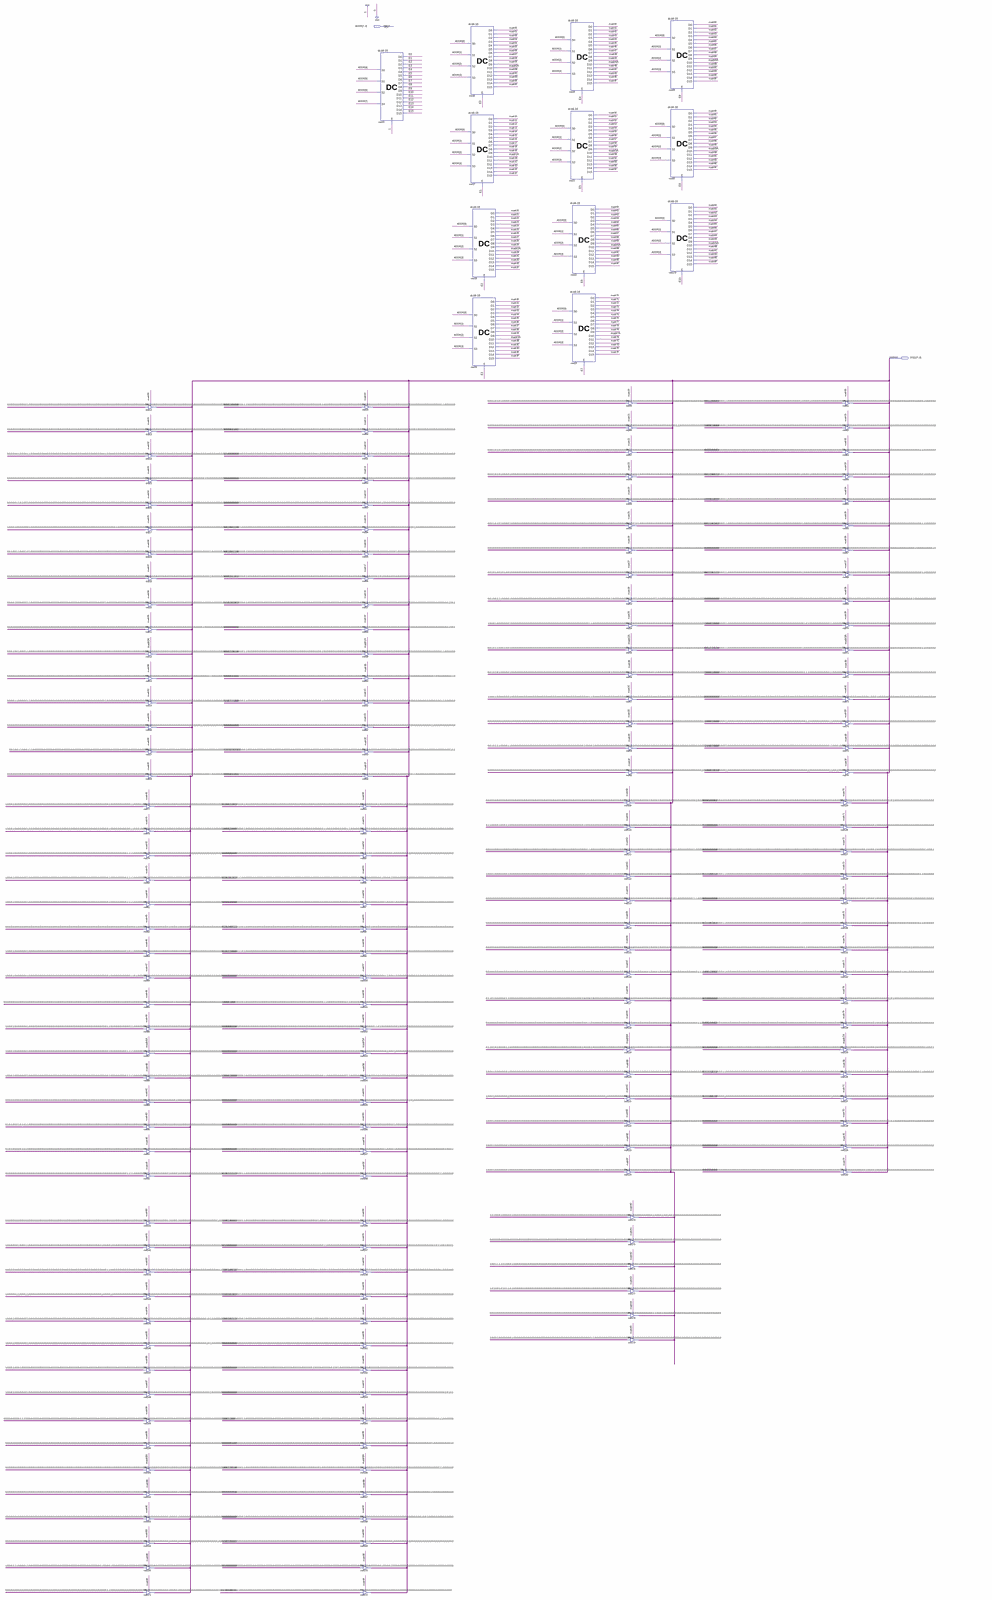
[diagram p0: schematic sheet, whole]
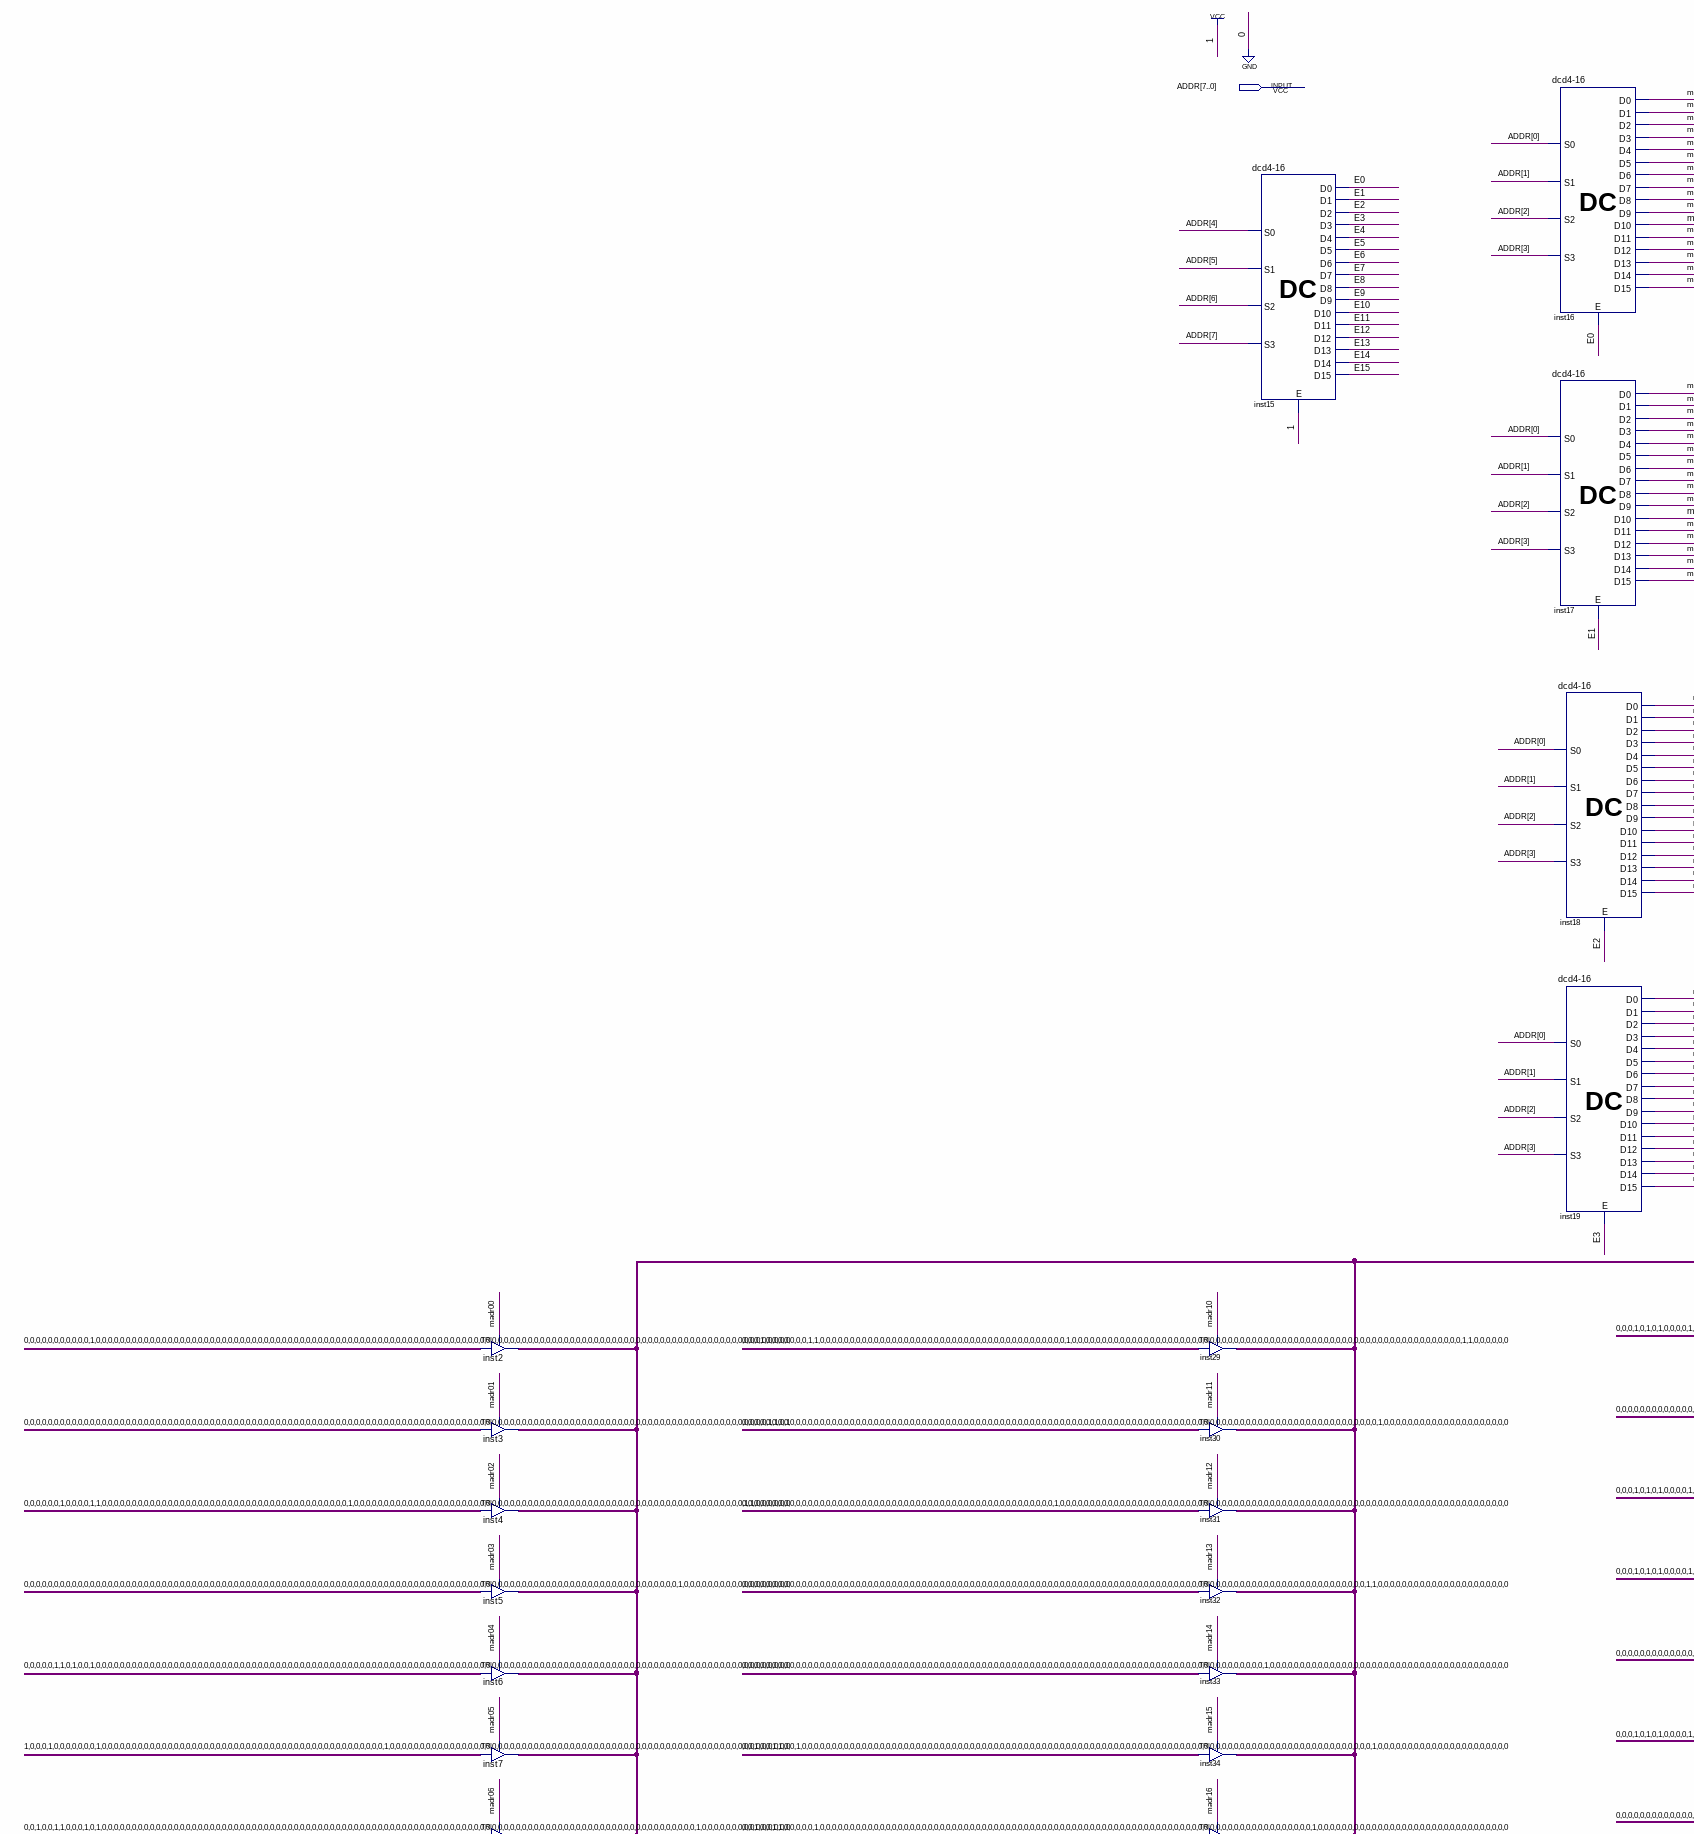
[diagram p1: schematic sheet, upper left part]
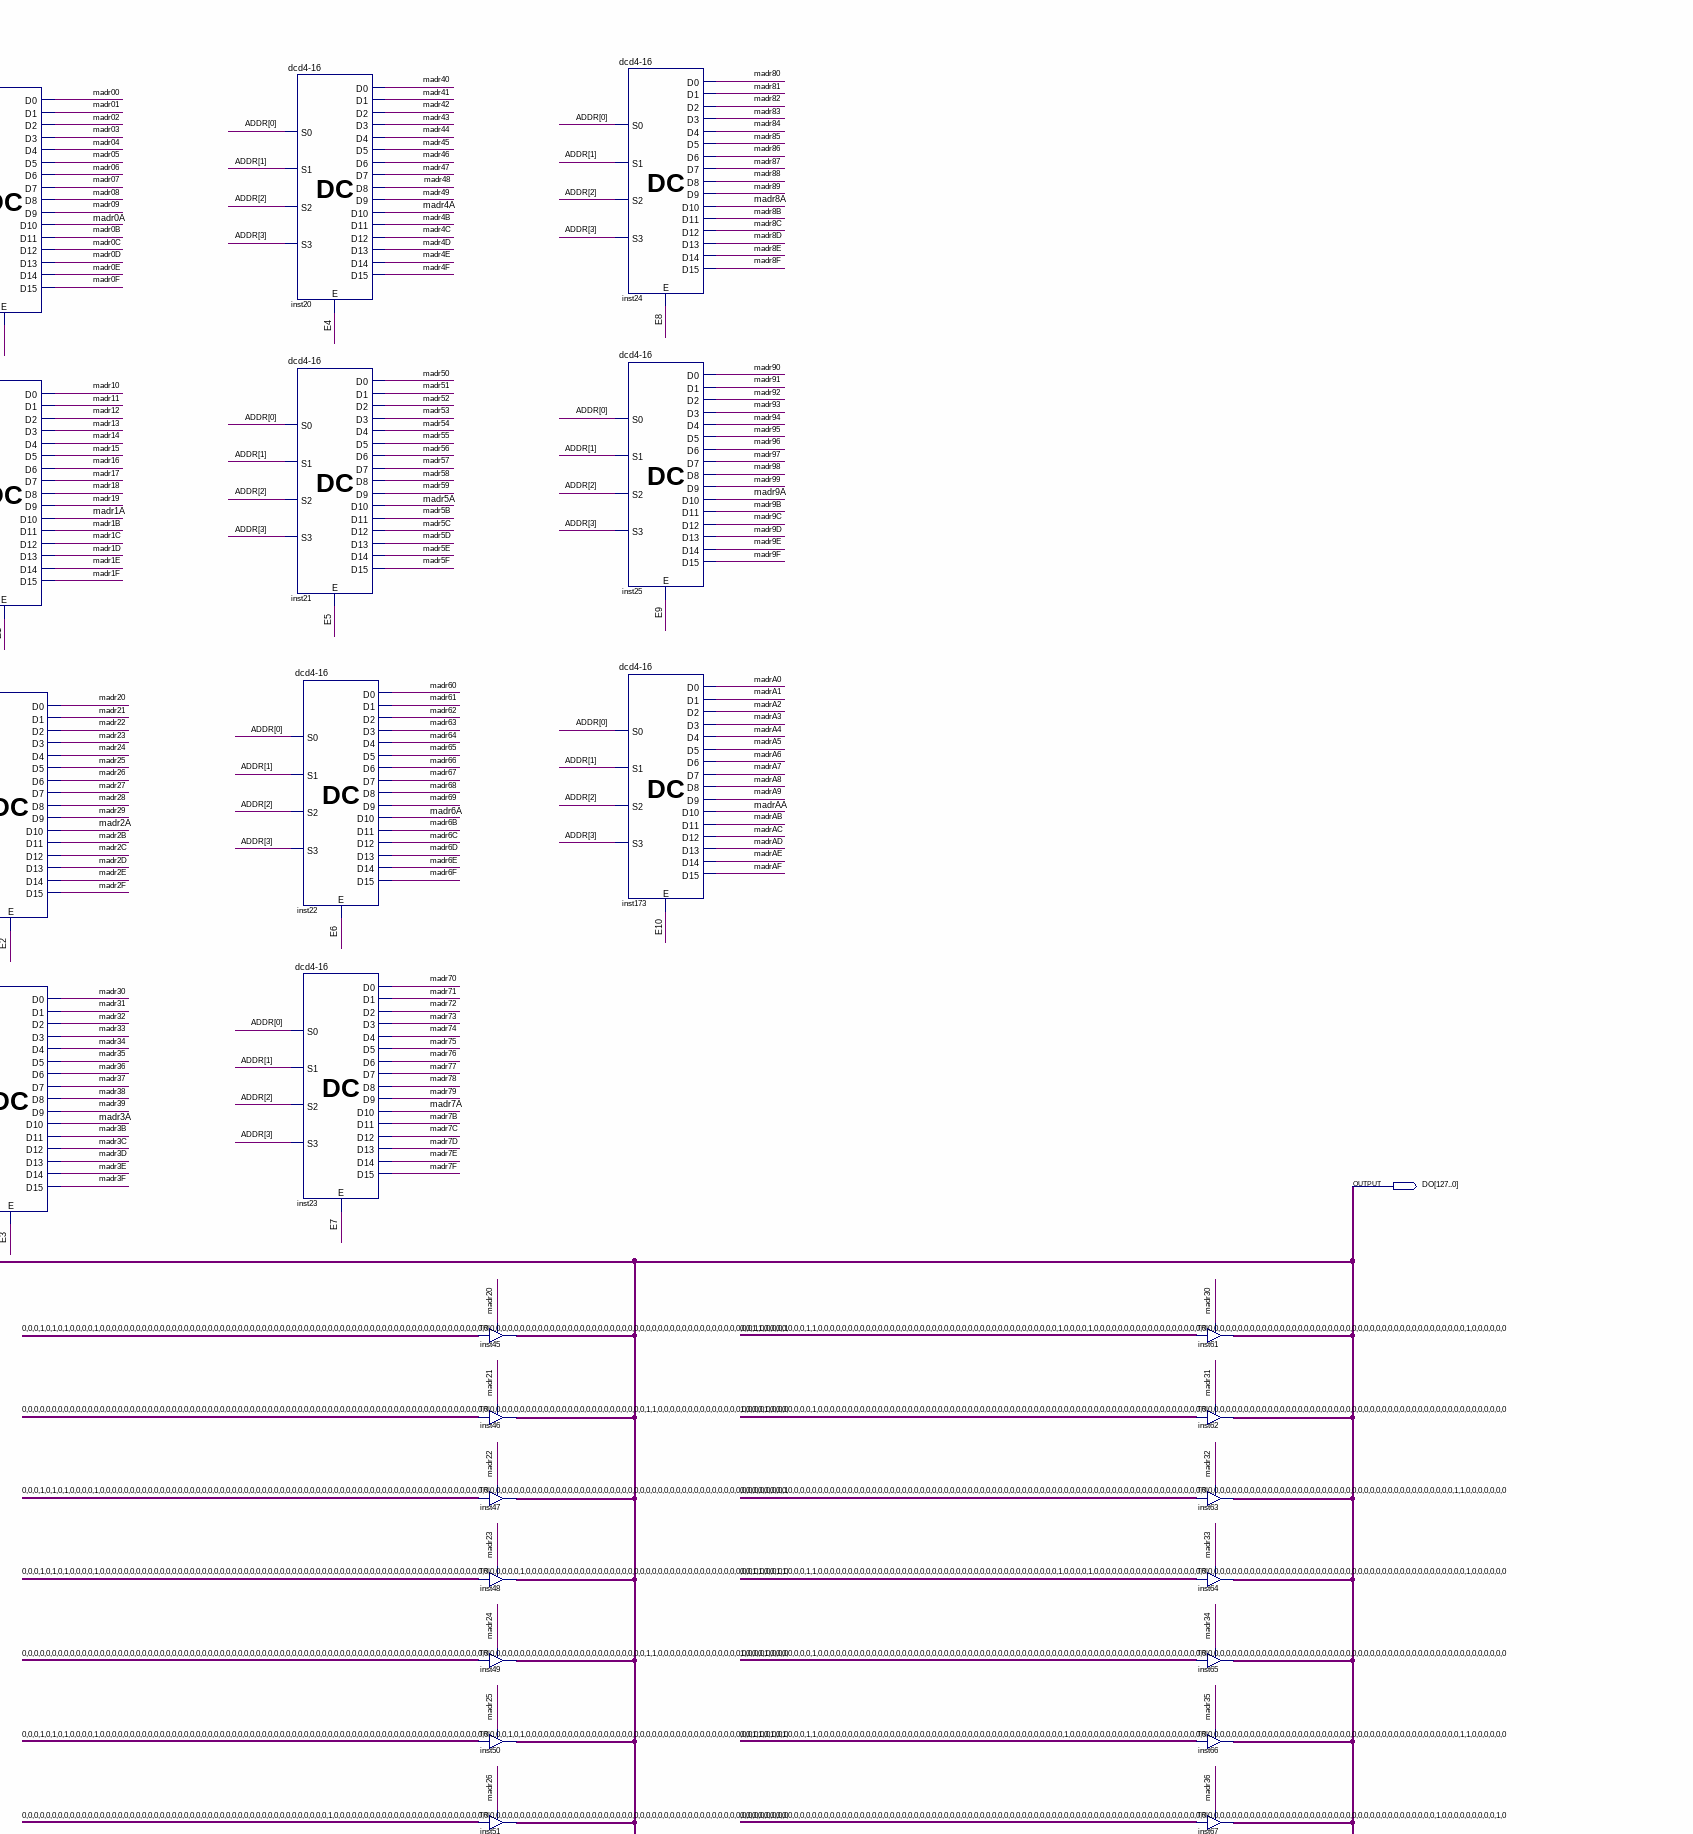
[diagram p2: schematic sheet, upper right part]
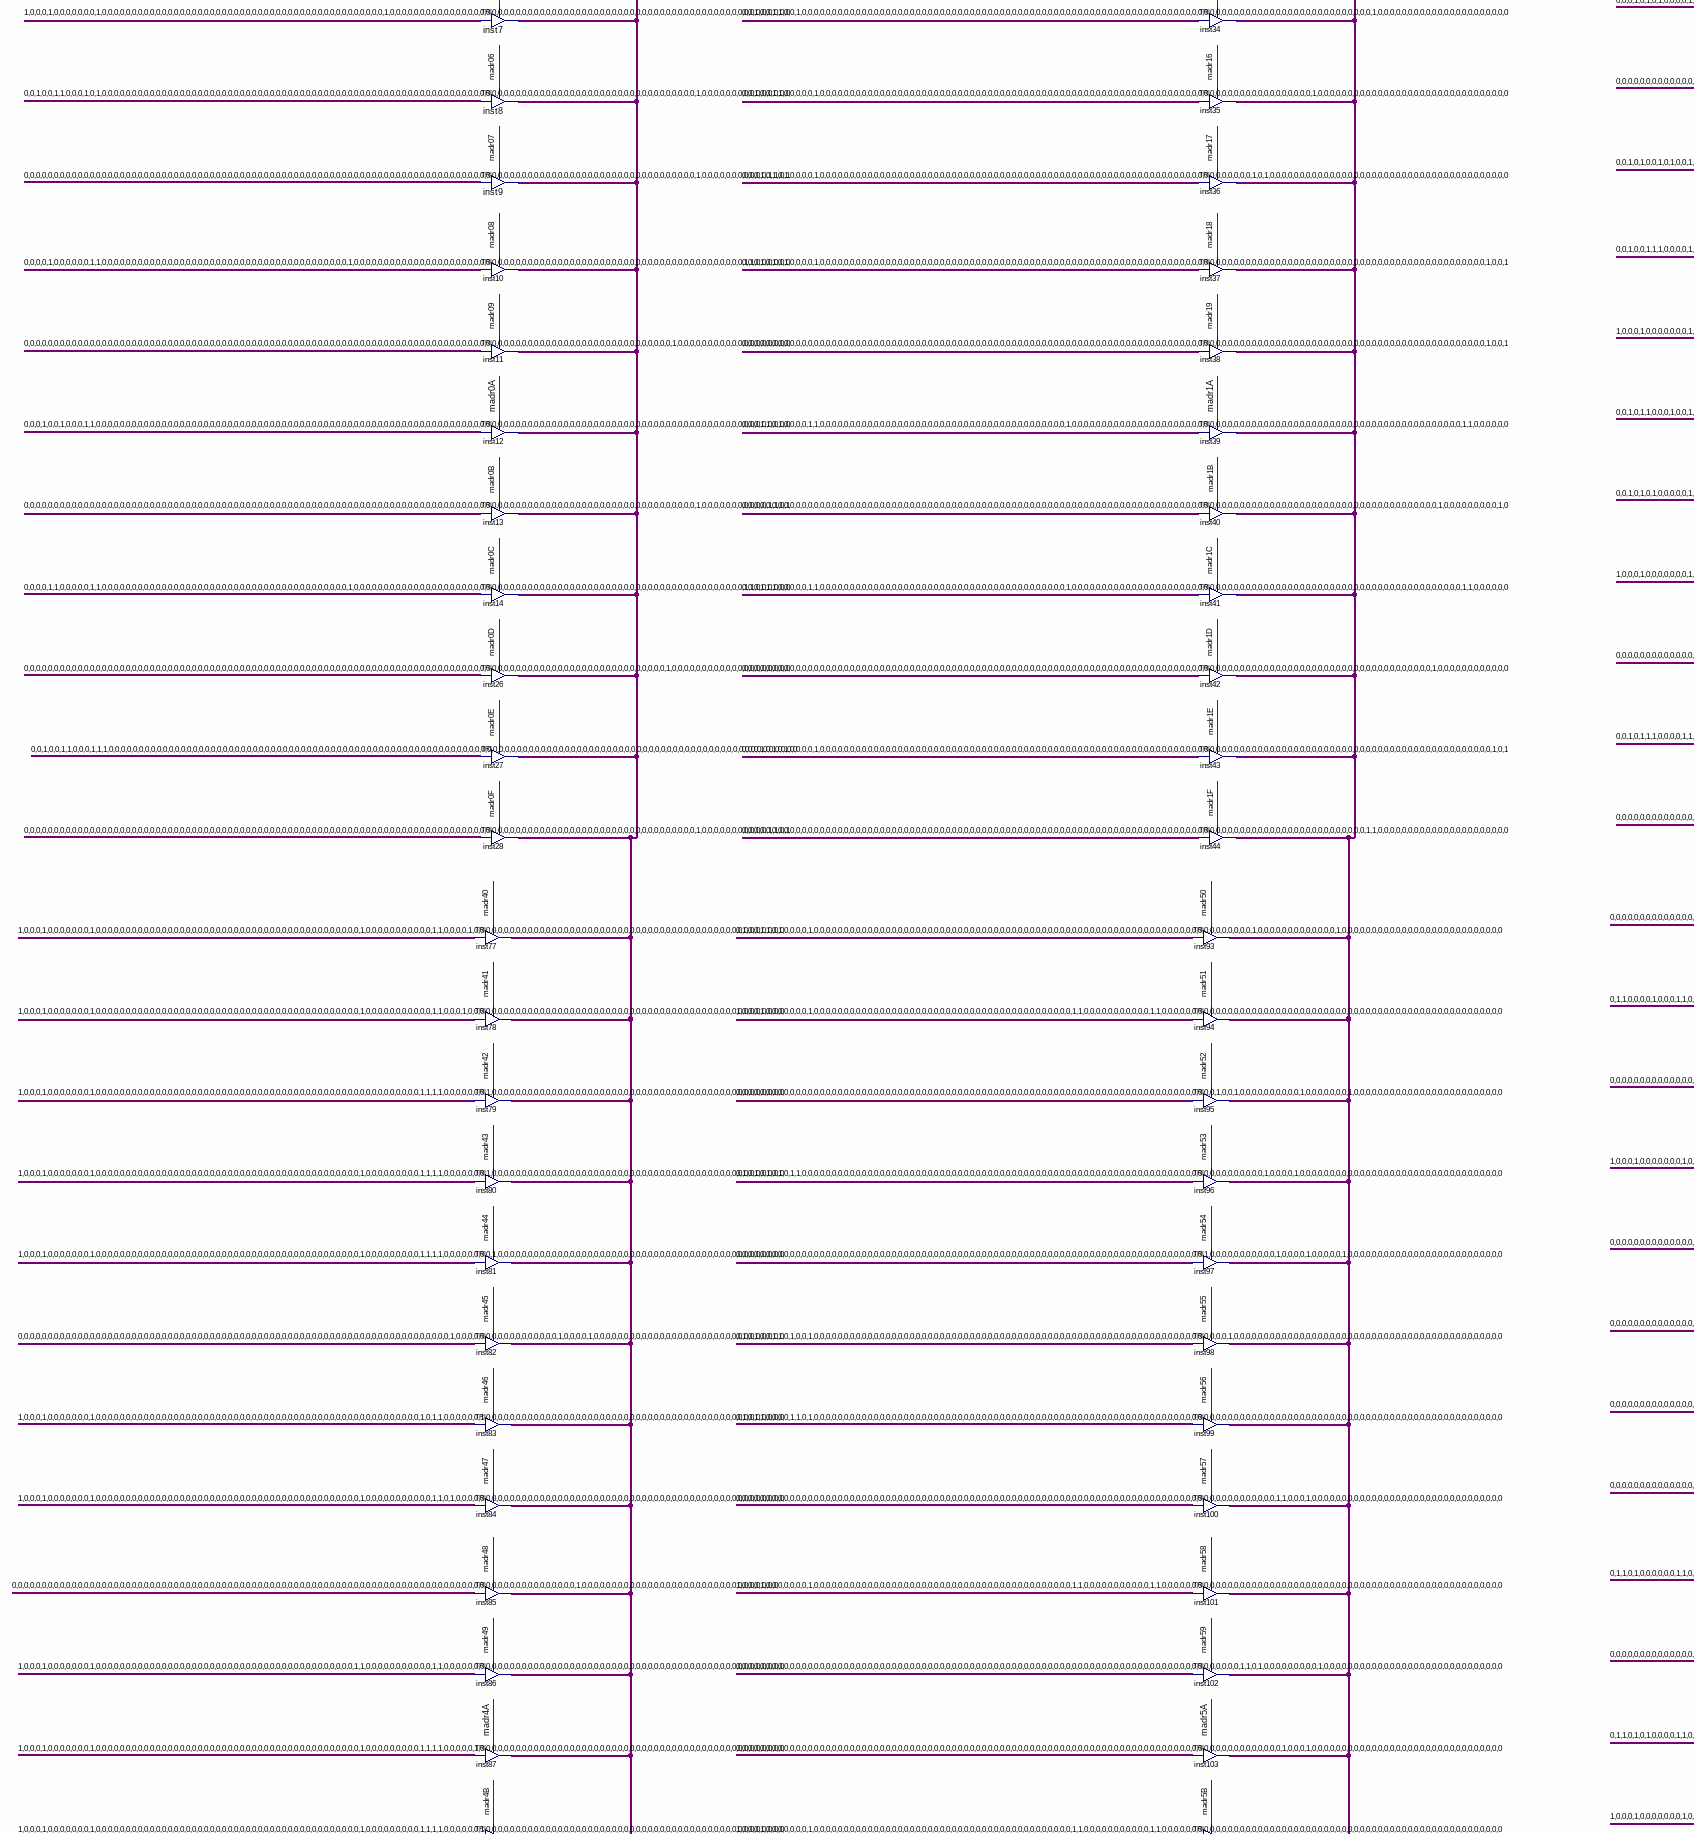
[diagram p3: schematic sheet, middle left part]
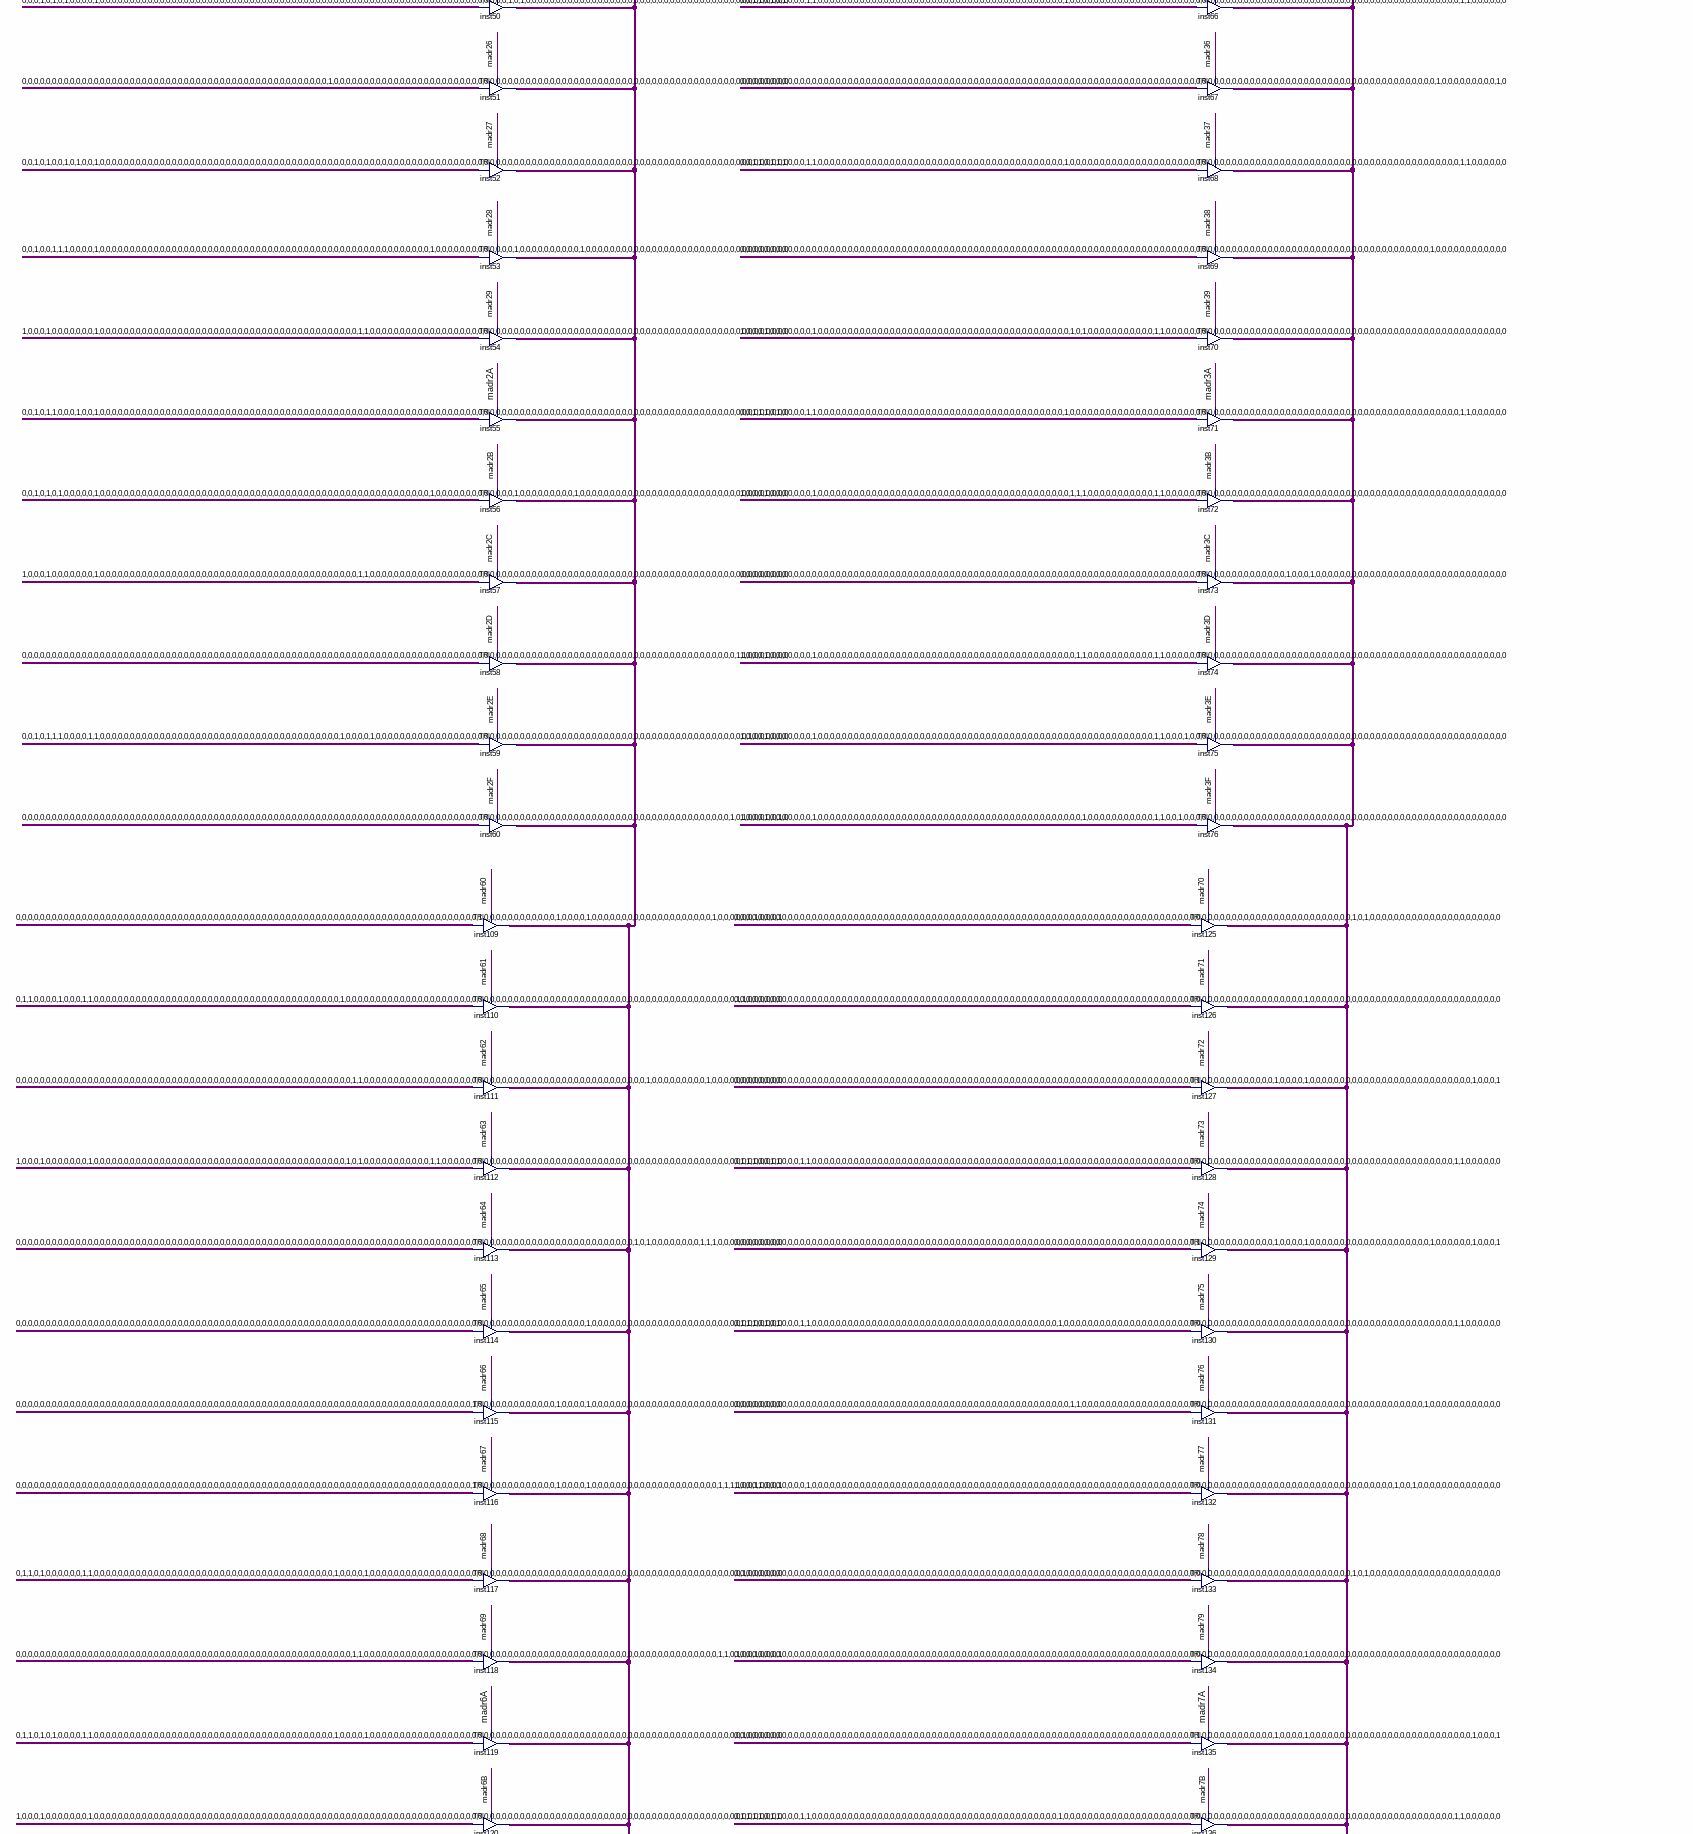
[diagram p4: schematic sheet, middle right part]
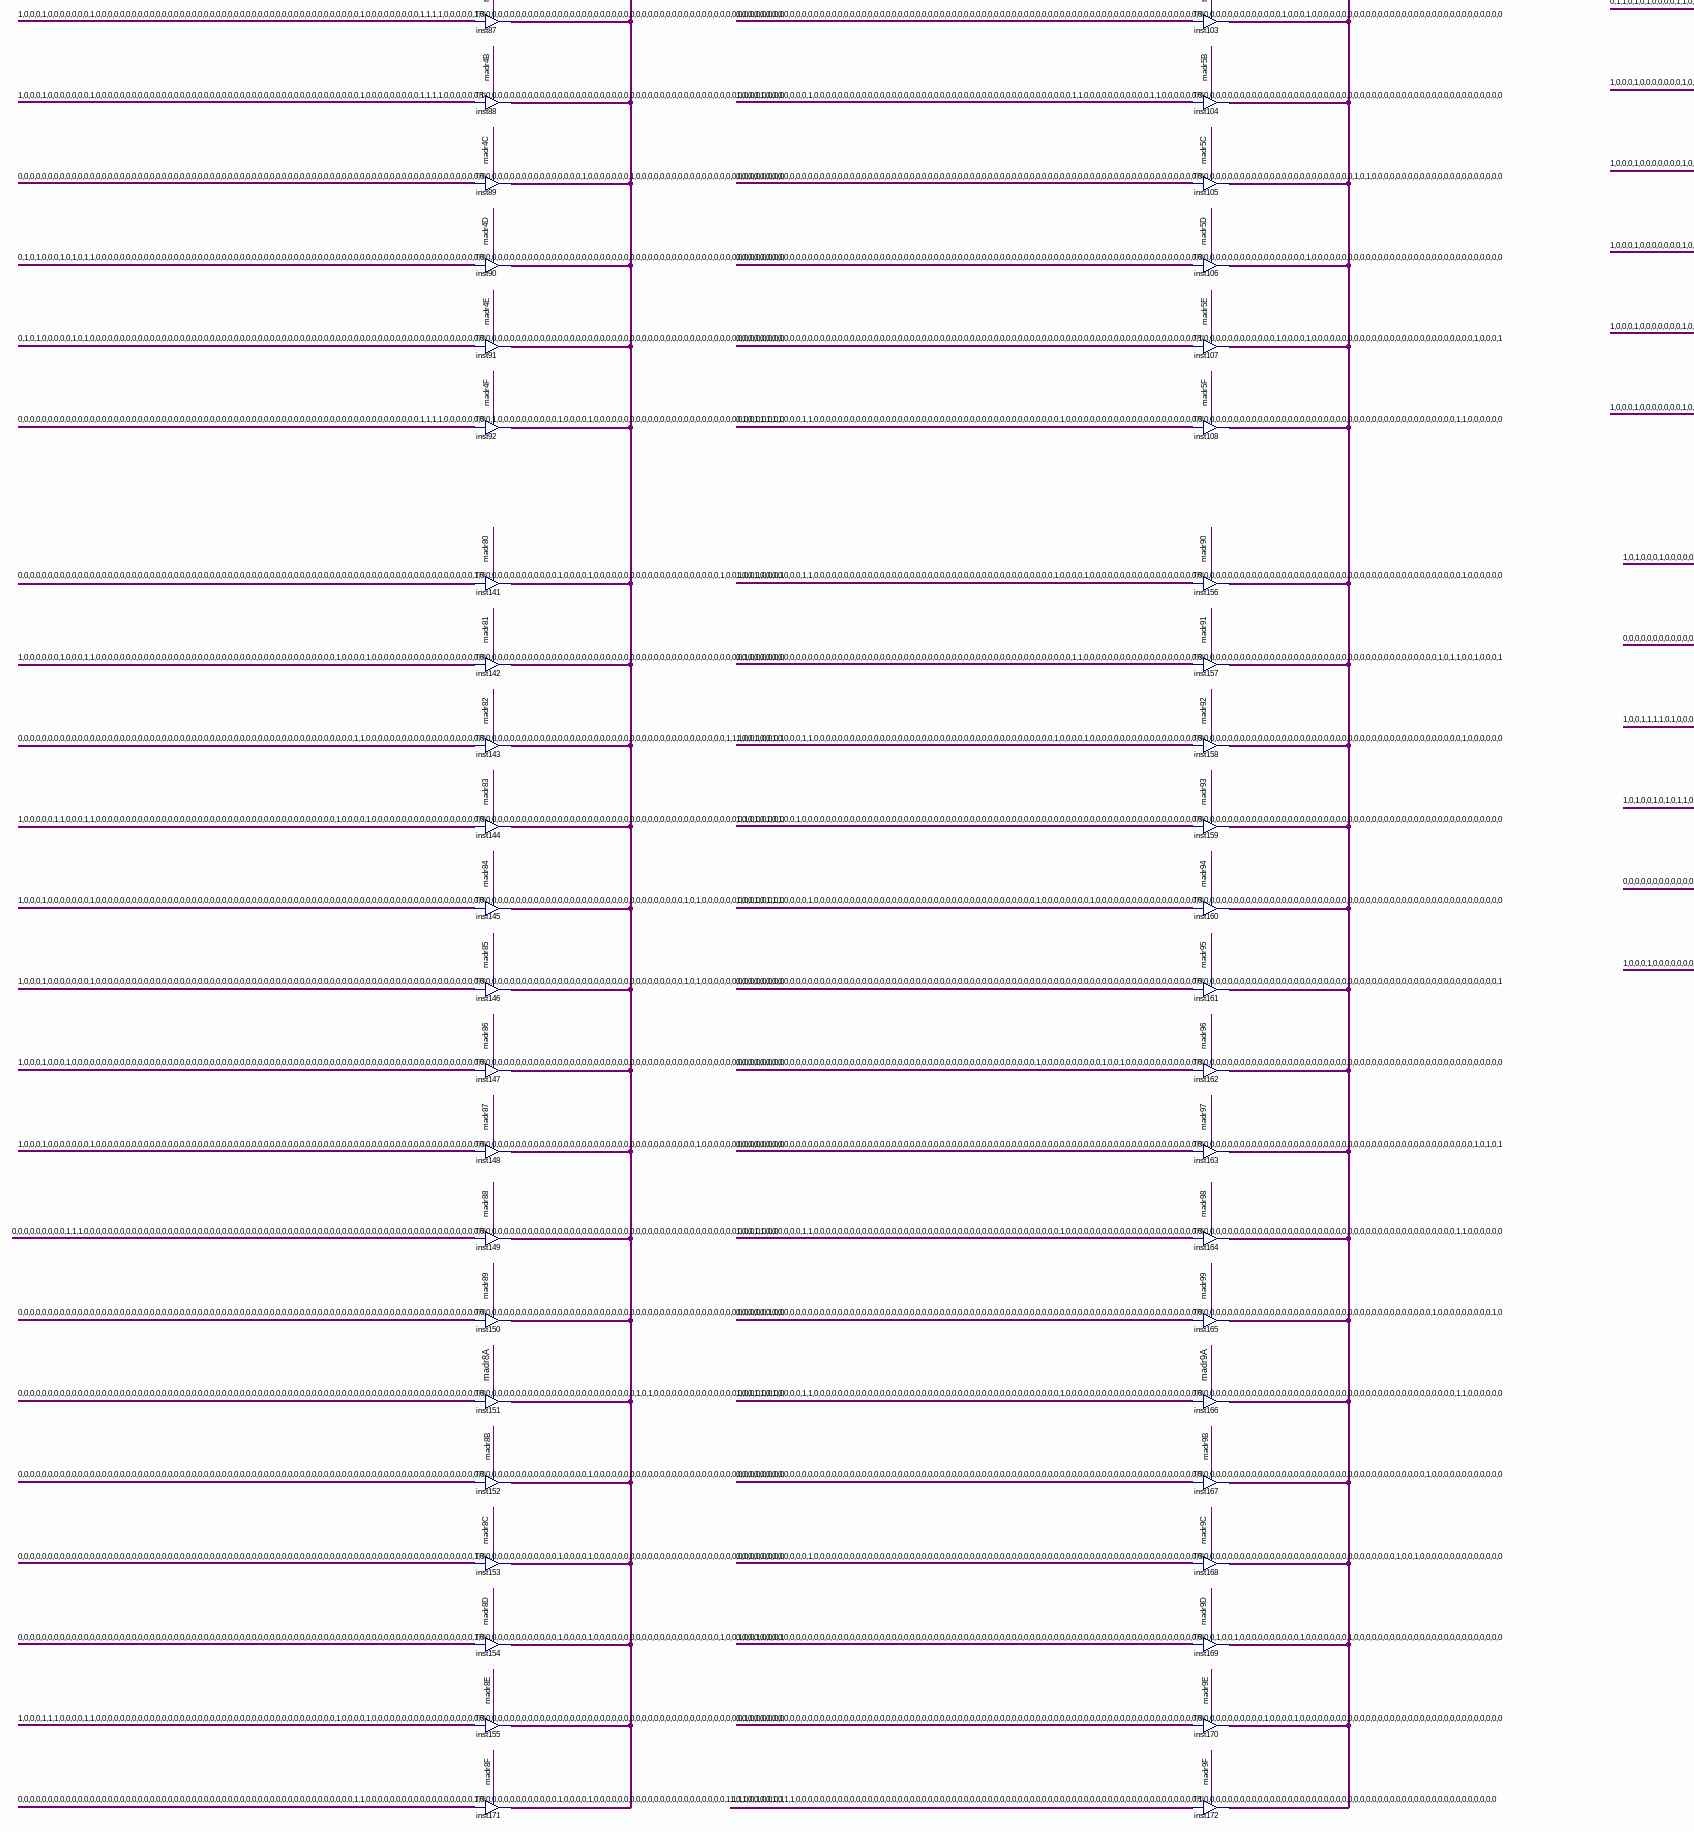
[diagram p5: schematic sheet, lower left part]
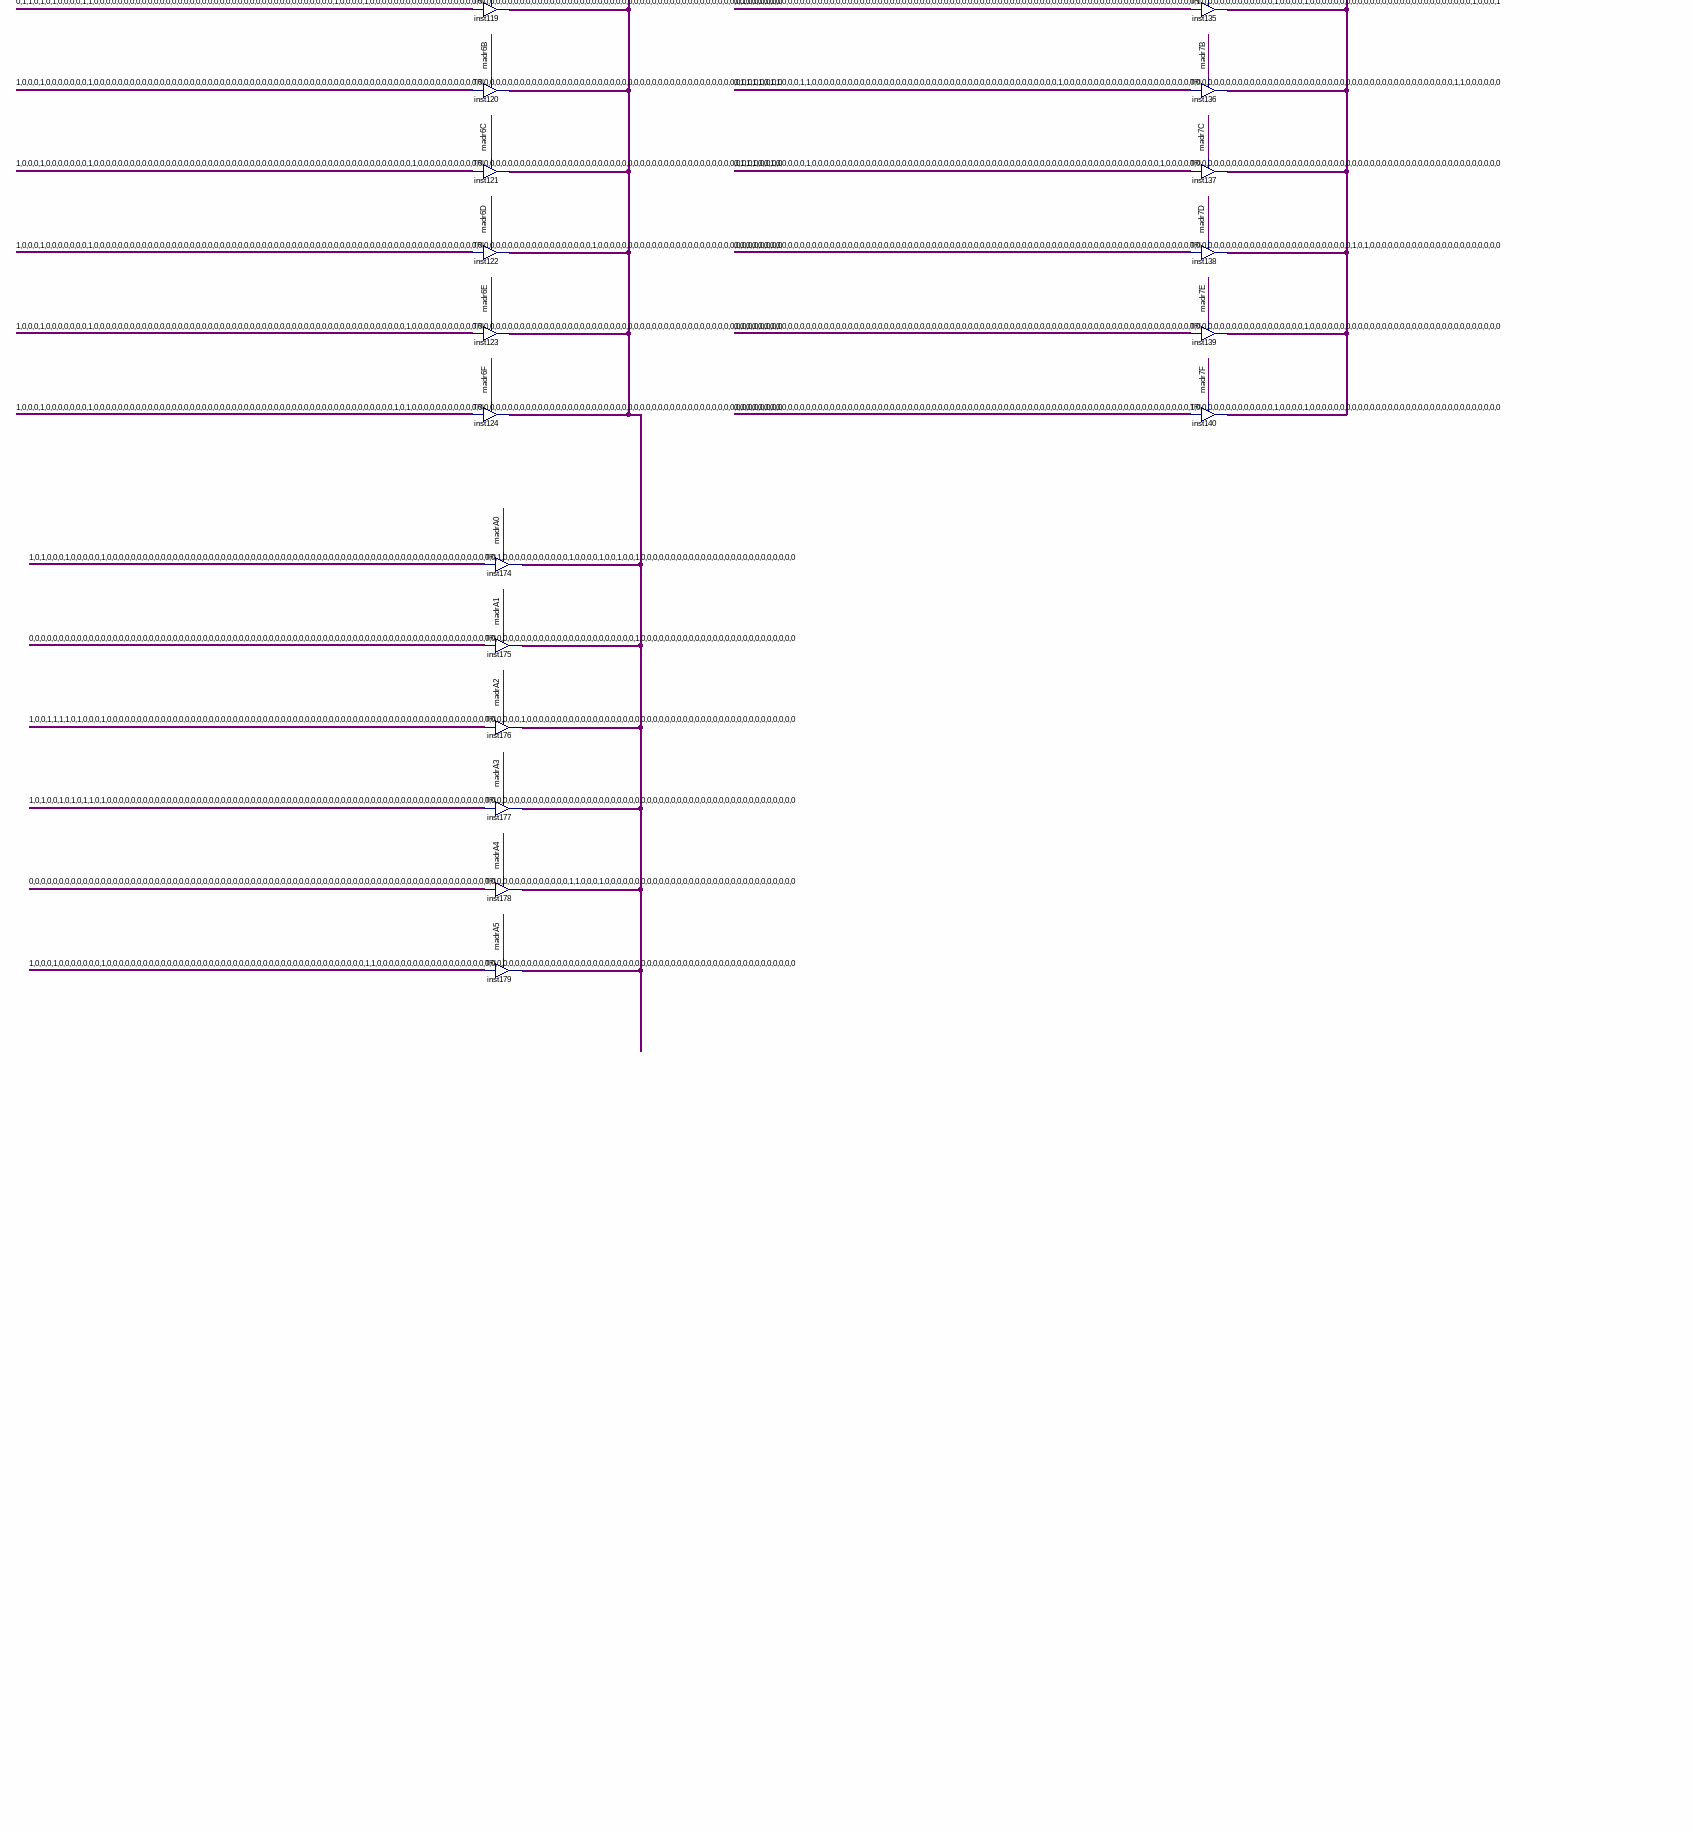
[diagram p6: schematic sheet, lower right part]
// Quartus schematic microProgram.bdf as structural Verilog: 178 symbols, 2 pins
module microProgram (
  input  [7:0] ADDR,
  output [127:0] DO
);

  wire E0, E1, E2, E3, E4, E5, E6, E7, E8, E9, E10, E11, E12, E13, E14, E15, madr00, madr0A, madr0B, madr0C,
       madr0D, madr0E, madr0F, madr01, madr1A, madr1B, madr1C, madr1D, madr1E, madr1F, madr02, madr2A,
       madr2B, madr2C, madr2D, madr2E, madr2F, madr03, madr3A, madr3B, madr3C, madr3D, madr3E, madr3F,
       madr04, madr4A, madr4B, madr4C, madr4D, madr4E, madr4F, madr05, madr5A, madr5B, madr5C, madr5D,
       madr5E, madr5F, madr06, madr6A, madr6B, madr6C, madr6D, madr6E, madr6F, madr07, madr7A, madr7B,
       madr7C, madr7D, madr7E, madr7F, madr08, madr8A, madr8B, madr8C, madr8D, madr8E, madr8F, madr09,
       madr9A, madr9B, madr9C, madr9D, madr9E, madr9F, madr10, madr11, madr12, madr13, madr14, madr15,
       madr16, madr17, madr18, madr19, madr20, madr21, madr22, madr23, madr24, madr25, madr26, madr27,
       madr28, madr29, madr30, madr31, madr32, madr33, madr34, madr35, madr36, madr37, madr38, madr39,
       madr40, madr41, madr42, madr43, madr44, madr45, madr46, madr47, madr48, madr49, madr50, madr51,
       madr52, madr53, madr54, madr55, madr56, madr57, madr58, madr59, madr60, madr61, madr62, madr63,
       madr64, madr65, madr66, madr67, madr68, madr69, madr70, madr71, madr72, madr73, madr74, madr75,
       madr76, madr77, madr78, madr79, madr80, madr81, madr82, madr83, madr84, madr85, madr86, madr87,
       madr88, madr89, madr90, madr91, madr92, madr93, madr94, madr95, madr96, madr97, madr98, madr99,
       madrA0, madrA1, madrA2, madrA3, madrA4, madrA5, madrA6, madrA7, madrA8, madrA9, madrAA, madrAB,
       madrAC, madrAD, madrAE, madrAF;

  TRI inst2[127:0] (
    .IN(128'b00000000000100000000000000000000000000000000000000000000000000000000000000000000000000000000000000000000000000000000000000000000),
    .OE(madr00), .OUT(DO));
  TRI inst3[127:0] (
    .IN(128'b00000000000000000000000000000000000000000000000000000000000000000000000000000000000000000000000000000000000000000000000000001101),
    .OE(madr01), .OUT(DO));
  TRI inst4[127:0] (
    .IN(128'b00000010000110000000000000000000000000000000000000000010000000000000000000000000000000000000000000000000000000000000000011000000),
    .OE(madr02), .OUT(DO));
  TRI inst5[127:0] (
    .IN(128'b00000000000000000000000000000000000000000000000000000000000000000000000000000000000000000000000000000000000001000000000000000000),
    .OE(madr03), .OUT(DO));
  TRI inst6[127:0] (
    .IN(128'b00000110100100000000000000000000000000000000000000000000000000000000000000000000000000000000000000000000000000000000000000000000),
    .OE(madr04), .OUT(DO));
  TRI inst7[127:0] (
    .IN(128'b10001000000010000000000000000000000000000000000000000000000010000000000000000000000000000000000000000000000000000000000000000000),
    .OE(madr05), .OUT(DO));
  TRI inst8[127:0] (
    .IN(128'b00100110001010000000000000000000000000000000000000000000000000000000000000000000000000000000000000000000000000001000000000000000),
    .OE(madr06), .OUT(DO));
  TRI inst9[127:0] (
    .IN(128'b00000000000000000000000000000000000000000000000000000000000000000000000000000000000000000000000000000000000000001000000000001101),
    .OE(madr07), .OUT(DO));
  TRI inst10[127:0] (
    .IN(128'b00001000000110000000000000000000000000000000000000000010000000000000000000000000000000000000000000000000000000000000000011000000),
    .OE(madr08), .OUT(DO));
  TRI inst11[127:0] (
    .IN(128'b00000000000000000000000000000000000000000000000000000000000000000000000000000000000000000000000000000000000010000000000000000000),
    .OE(madr09), .OUT(DO));
  TRI inst12[127:0] (
    .IN(128'b00010010001100000000000000000000000000000000000000000000000000000000000000000000000000000000000000000000000000000000000000000000),
    .OE(madr0A), .OUT(DO));
  TRI inst13[127:0] (
    .IN(128'b00000000000000000000000000000000000000000000000000000000000000000000000000000000000000000000000000000000000000001000000000001101),
    .OE(madr0B), .OUT(DO));
  TRI inst14[127:0] (
    .IN(128'b00001100000110000000000000000000000000000000000000000010000000000000000000000000000000000000000000000000000000000000000011000000),
    .OE(madr0C), .OUT(DO));
  TRI inst26[127:0] (
    .IN(128'b00000000000000000000000000000000000000000000000000000000000000000000000000000000000000000000000000000000000100000000000000000000),
    .OE(madr0D), .OUT(DO));
  TRI inst27[127:0] (
    .IN(128'b00100110001110000000000000000000000000000000000000000000000000000000000000000000000000000000000000000000000000000000000000000000),
    .OE(madr0E), .OUT(DO));
  TRI inst28[127:0] (
    .IN(128'b00000000000000000000000000000000000000000000000000000000000000000000000000000000000000000000000000000000000000001000000000001101),
    .OE(madr0F), .OUT(DO));
  TRI inst77[127:0] (
    .IN(128'b10001000000010000000000000000000000000000000000000000000010000000000011000010000000000000000000000000000000000000000000000000000),
    .OE(madr40), .OUT(DO));
  TRI inst78[127:0] (
    .IN(128'b10001000000010000000000000000000000000000000000000000000010000000000011000100000000000000000000000000000000000000000000000000000),
    .OE(madr41), .OUT(DO));
  TRI inst79[127:0] (
    .IN(128'b10001000000010000000000000000000000000000000000000000000000000000001111000000010000000000000000000000000000000000000000000000000),
    .OE(madr42), .OUT(DO));
  TRI inst80[127:0] (
    .IN(128'b10001000000010000000000000000000000000000000000000000000010000000001111000000010000000000000000000000000000000000000000000000000),
    .OE(madr43), .OUT(DO));
  TRI inst81[127:0] (
    .IN(128'b10001000000010000000000000000000000000000000000000000000010000000001111000000001000000000000000000000000000000000000000000000000),
    .OE(madr44), .OUT(DO));
  TRI inst82[127:0] (
    .IN(128'b00000000000000000000000000000000000000000000000000000000000000000000000010000000000000000010000100000000000000000000000000000000),
    .OE(madr45), .OUT(DO));
  TRI inst83[127:0] (
    .IN(128'b10001000000010000000000000000000000000000000000000000000000000000001011000000100000000000000000000000000000000000000000000000000),
    .OE(madr46), .OUT(DO));
  TRI inst84[127:0] (
    .IN(128'b10001000000010000000000000000000000000000000000000000000010000000000011010000000000000000000000000000000000000000000000000000000),
    .OE(madr47), .OUT(DO));
  TRI inst85[127:0] (
    .IN(128'b00000000000000000000000000000000000000000000000000000000000000000000000000000000000000000000001000000000000000000000000000000000),
    .OE(madr48), .OUT(DO));
  TRI inst86[127:0] (
    .IN(128'b10001000000010000000000000000000000000000000000000000000110000000000011000000000000000000000000000000000000000000000000000000000),
    .OE(madr49), .OUT(DO));
  TRI inst87[127:0] (
    .IN(128'b10001000000010000000000000000000000000000000000000000000010000000001111000001000000000000000000000000000000000000000000000000000),
    .OE(madr4A), .OUT(DO));
  TRI inst88[127:0] (
    .IN(128'b10001000000010000000000000000000000000000000000000000000010000000001111000000100000000000000000000000000000000000000000000000000),
    .OE(madr4B), .OUT(DO));
  TRI inst89[127:0] (
    .IN(128'b00000000000000000000000000000000000000000000000000000000000000000000000000000000000000000000001000000010000000000000000000000000),
    .OE(madr4C), .OUT(DO));
  TRI inst90[127:0] (
    .IN(128'b01010001010110000000000000000000000000000000000000000000000000000000000000000000000000000000000000000000000000000000000000000000),
    .OE(madr4D), .OUT(DO));
  TRI inst91[127:0] (
    .IN(128'b01010000010100000000000000000000000000000000000000000000000000000000000000000000000000000000000000000000000000000000000000000000),
    .OE(madr4E), .OUT(DO));
  TRI inst92[127:0] (
    .IN(128'b00000000000000000000000000000000000000000000000000000000000000000001111000000001000000000010000100000000000000000000000000000000),
    .OE(madr4F), .OUT(DO));
  TRI inst141[127:0] (
    .IN(128'b00000000000000000000000000000000000000000000000000000000000000000000000000001000000000000010000100000000000000000000010010010001),
    .OE(madr80), .OUT(DO));
  TRI inst142[127:0] (
    .IN(128'b10000001000110000000000000000000000000000000000000000100001000000000000000000000000000000000000000000000000000000000000001000000),
    .OE(madr81), .OUT(DO));
  TRI inst143[127:0] (
    .IN(128'b00000000000000000000000000000000000000000000000000000000110000000000000000000000000000000000000000000000000000000000001110010001),
    .OE(madr82), .OUT(DO));
  TRI inst144[127:0] (
    .IN(128'b10000011000110000000000000000000000000000000000000000100001000000000000000000000000000000000000000000000000000000000000001000000),
    .OE(madr83), .OUT(DO));
  TRI inst145[127:0] (
    .IN(128'b10001000000010000000000000000000000000000000000000000000000000000000000000000000000000000000000000000000000000010100000000000000),
    .OE(madr84), .OUT(DO));
  TRI inst146[127:0] (
    .IN(128'b10001000000010000000000000000000000000000000000000000000000000000000000000000000000000000000000000000000000000010100000000000000),
    .OE(madr85), .OUT(DO));
  TRI inst147[127:0] (
    .IN(128'b10001000100000000000000000000000000000000000000000000000000000000000000000000000000000000000000000000000000000000000000000000000),
    .OE(madr86), .OUT(DO));
  TRI inst148[127:0] (
    .IN(128'b10001000000010000000000000000000000000000000000000000000000000000000000000000000000000000000000000000000000000000100000000000000),
    .OE(madr87), .OUT(DO));
  TRI inst149[127:0] (
    .IN(128'b00000000011100000000000000000000000000000000000000000000000000000000000000000000000000000000000000000000000000000000000000000000),
    .OE(madr88), .OUT(DO));
  TRI inst150[127:0] (
    .IN(128'b00000000000000000000000000000000000000000000000000000000000000000000000000000000000000000000000000000000000000000000000000000100),
    .OE(madr89), .OUT(DO));
  TRI inst151[127:0] (
    .IN(128'b00000000000000000000000000000000000000000000000000000000000000000000000000000000000000000000000000000001010000000000000000000000),
    .OE(madr8A), .OUT(DO));
  TRI inst152[127:0] (
    .IN(128'b00000000000000000000000000000000000000000000000000000000000000000000000000000000000000000000000100000000000000000000000000000000),
    .OE(madr8B), .OUT(DO));
  TRI inst153[127:0] (
    .IN(128'b00000000000000000000000000000000000000000000000000000000000000000000000000001000000000000010000100000000000000000000000000000000),
    .OE(madr8C), .OUT(DO));
  TRI inst154[127:0] (
    .IN(128'b00000000000000000000000000000000000000000000000000000000000000000000000000001000000000000010000100000000000000000000010010010001),
    .OE(madr8D), .OUT(DO));
  TRI inst155[127:0] (
    .IN(128'b10001110000110000000000000000000000000000000000000000100001000000000000000000000000000000000000000000000000000000000000001000000),
    .OE(madr8E), .OUT(DO));
  TRI inst171[127:0] (
    .IN(128'b00000000000000000000000000000000000000000000000000000000110000000000000000001000000000000010000100000000000000000000001110010001),
    .OE(madr8F), .OUT(DO));
  TRI inst29[127:0] (
    .IN(128'b00010000000110000000000000000000000000000000000000000010000000000000000000000000000000000000000000000000000000000000000011000000),
    .OE(madr10), .OUT(DO));
  TRI inst30[127:0] (
    .IN(128'b00000000000000000000000000000000000000000000000000000000000000000000000000000000000000000000000000000000001000000000000000000000),
    .OE(madr11), .OUT(DO));
  TRI inst31[127:0] (
    .IN(128'b00000000000000000000000000000000000000000000000000001000000000000000000000000000000000000000000000000000000000000000000000000000),
    .OE(madr12), .OUT(DO));
  TRI inst32[127:0] (
    .IN(128'b00000000000000000000000000000000000000000000000000000000000000000000000000000000000000000000000000000000110000000000000000000000),
    .OE(madr13), .OUT(DO));
  TRI inst33[127:0] (
    .IN(128'b00000000000000000000000000000000000000000000000000000000000000000000000000000000000000010000000000000000000000000000000000000000),
    .OE(madr14), .OUT(DO));
  TRI inst34[127:0] (
    .IN(128'b00100110010000000000000000000000000000000000000000000000000000000000000000000000000000000000000000000000010000000000000000000000),
    .OE(madr15), .OUT(DO));
  TRI inst35[127:0] (
    .IN(128'b00100110000010000000000000000000000000000000000000000000000000000000000000000000000000000000000100000000000000000000000000000000),
    .OE(madr16), .OUT(DO));
  TRI inst36[127:0] (
    .IN(128'b00010101000010000000000000000000000000000000000000000000000000000000000000000000000001010000000000000000000000000000000000000000),
    .OE(madr17), .OUT(DO));
  TRI inst37[127:0] (
    .IN(128'b00010101000010000000000000000000000000000000000000000000000000000000000000000000000000000000000000000000000000000000000000001001),
    .OE(madr18), .OUT(DO));
  TRI inst38[127:0] (
    .IN(128'b00000000000000000000000000000000000000000000000000000000000000000000000000000000000000000000000000000000000000000000000000001001),
    .OE(madr19), .OUT(DO));
  TRI inst39[127:0] (
    .IN(128'b00011010000110000000000000000000000000000000000000000010000000000000000000000000000000000000000000000000000000000000000011000000),
    .OE(madr1A), .OUT(DO));
  TRI inst40[127:0] (
    .IN(128'b00000000000000000000000000000000000000000000000000000000000000000000000000000000000000000000000000000000000000000000100000000010),
    .OE(madr1B), .OUT(DO));
  TRI inst41[127:0] (
    .IN(128'b00011100000110000000000000000000000000000000000000000010000000000000000000000000000000000000000000000000000000000000000011000000),
    .OE(madr1C), .OUT(DO));
  TRI inst42[127:0] (
    .IN(128'b00000000000000000000000000000000000000000000000000000000000000000000000000000000000000000000000000000000000000000001000000000000),
    .OE(madr1D), .OUT(DO));
  TRI inst43[127:0] (
    .IN(128'b00010101000010000000000000000000000000000000000000000000000000000000000000000000000000000000000000000000000000000000000000000101),
    .OE(madr1E), .OUT(DO));
  TRI inst44[127:0] (
    .IN(128'b00000000000000000000000000000000000000000000000000000000000000000000000000000000000000000000000000000000110000000000000000000000),
    .OE(madr1F), .OUT(DO));
  TRI inst93[127:0] (
    .IN(128'b01001101000010000000000000000000000000000000000000000000000000000000000000000000000000100000000000001000000000000000000000000000),
    .OE(madr50), .OUT(DO));
  TRI inst94[127:0] (
    .IN(128'b10001000000010000000000000000000000000000000000000000000110000000000011000000000000000000000000000000000000000000000000000000000),
    .OE(madr51), .OUT(DO));
  TRI inst95[127:0] (
    .IN(128'b00000000000000000000000000000000000000000000000000000000000000000000000000000000100100000000001000000010000000000000000000000000),
    .OE(madr52), .OUT(DO));
  TRI inst96[127:0] (
    .IN(128'b01010101011000000000000000000000000000000000000000000000000000000000000000000000000000001000010000000000000000000000000000000000),
    .OE(madr53), .OUT(DO));
  TRI inst97[127:0] (
    .IN(128'b00000000000000000000000000000000000000000000000000000000000000000000000000000010000000000010000100000100000000000000000000000000),
    .OE(madr54), .OUT(DO));
  TRI inst98[127:0] (
    .IN(128'b01010011010010000000000000000000000000000000000000000000000000000000000000000000001000000000000000000000000000000000000000000000),
    .OE(madr55), .OUT(DO));
  TRI inst99[127:0] (
    .IN(128'b01011000011010000000000000000000000000000000000000000000000000000000000000000000000000000000000000000000000000000000000000000000),
    .OE(madr56), .OUT(DO));
  TRI inst100[127:0] (
    .IN(128'b00000000000000000000000000000000000000000000000000000000000000000000000000000000000000000011000100000000000000000000000000000000),
    .OE(madr57), .OUT(DO));
  TRI inst101[127:0] (
    .IN(128'b10001000000010000000000000000000000000000000000000000000110000000000011000000000000000000000000000000000000000000000000000000000),
    .OE(madr58), .OUT(DO));
  TRI inst102[127:0] (
    .IN(128'b00000000000000000000000000000000000000000000000000000000000000000000000000000000000011010000000001000000000000000000000000000000),
    .OE(madr59), .OUT(DO));
  TRI inst103[127:0] (
    .IN(128'b00000000000000000000000000000000000000000000000000000000000000000000000000000000000000000001000100000000000000000000000000000000),
    .OE(madr5A), .OUT(DO));
  TRI inst104[127:0] (
    .IN(128'b10001000000010000000000000000000000000000000000000000000110000000000011000000000000000000000000000000000000000000000000000000000),
    .OE(madr5B), .OUT(DO));
  TRI inst105[127:0] (
    .IN(128'b00000000000000000000000000000000000000000000000000000000000000000000000000000000000000000000000000000001010000000000000000000000),
    .OE(madr5C), .OUT(DO));
  TRI inst106[127:0] (
    .IN(128'b00000000000000000000000000000000000000000000000000000000000000000000000000000000000000000000000100000000000000000000000000000000),
    .OE(madr5D), .OUT(DO));
  TRI inst107[127:0] (
    .IN(128'b00000000000000000000000000000000000000000000000000000000000000000000000000000100000000000010000100000000000000000000000000010001),
    .OE(madr5E), .OUT(DO));
  TRI inst108[127:0] (
    .IN(128'b01011111000110000000000000000000000000000000000000000010000000000000000000000000000000000000000000000000000000000000000011000000),
    .OE(madr5F), .OUT(DO));
  TRI inst156[127:0] (
    .IN(128'b10010000000110000000000000000000000000000000000000000100001000000000000000000000000000000000000000000000000000000000000001000000),
    .OE(madr90), .OUT(DO));
  TRI inst157[127:0] (
    .IN(128'b00000000000000000000000000000000000000000000000000000000110000000000000000000000000000000000000000000000000000000000010110010001),
    .OE(madr91), .OUT(DO));
  TRI inst158[127:0] (
    .IN(128'b10010010000110000000000000000000000000000000000000000100001000000000000000000000000000000000000000000000000000000000000001000000),
    .OE(madr92), .OUT(DO));
  TRI inst159[127:0] (
    .IN(128'b10010101001000000000000000000000000000000000000000000000000000000000000000000000000000000000000000000000000000000000000000000000),
    .OE(madr93), .OUT(DO));
  TRI inst160[127:0] (
    .IN(128'b10010111000010000000000000000000000000000000000000100000000100000000000000000000000000000000000000000000000000000000000000000000),
    .OE(madr94), .OUT(DO));
  TRI inst161[127:0] (
    .IN(128'b00000000000000000000000000000000000000000000000000000000000000000000000000000000000000000000000000000000000000000000000000000001),
    .OE(madr95), .OUT(DO));
  TRI inst162[127:0] (
    .IN(128'b00000000000000000000000000000000000000000000000000100000000001001000000000000000000000000000000000000000000000000000000000000000),
    .OE(madr96), .OUT(DO));
  TRI inst163[127:0] (
    .IN(128'b00000000000000000000000000000000000000000000000000000000000000000000000000000000000000000000000000000000000000000000000000010101),
    .OE(madr97), .OUT(DO));
  TRI inst164[127:0] (
    .IN(128'b10011000000110000000000000000000000000000000000000000010000000000000000000000000000000000000000000000000000000000000000011000000),
    .OE(madr98), .OUT(DO));
  TRI inst165[127:0] (
    .IN(128'b00000000000000000000000000000000000000000000000000000000000000000000000000000000000000000000000000000000000000000000100000000010),
    .OE(madr99), .OUT(DO));
  TRI inst166[127:0] (
    .IN(128'b10011010000110000000000000000000000000000000000000000010000000000000000000000000000000000000000000000000000000000000000011000000),
    .OE(madr9A), .OUT(DO));
  TRI inst167[127:0] (
    .IN(128'b00000000000000000000000000000000000000000000000000000000000000000000000000000000000000000000000000000000000000000001000000000000),
    .OE(madr9B), .OUT(DO));
  TRI inst168[127:0] (
    .IN(128'b00000000000010000000000000000000000000000000000000000000000000000000000000000000000000000000000000000000000000100100000000000000),
    .OE(madr9C), .OUT(DO));
  TRI inst169[127:0] (
    .IN(128'b00000000000000000000000000000000000000000000000000000000000000000000000000000000100100000000001000000010000000000000000000000000),
    .OE(madr9D), .OUT(DO));
  TRI inst170[127:0] (
    .IN(128'b00000000000000000000000000000000000000000000000000000000000000000000000000000000000000001000010000000000000000000000000000000000),
    .OE(madr9E), .OUT(DO));
  TRI inst172[127:0] (
    .IN(128'b10100001011000000000000000000000000000000000000000000000000000000000000000000010000000000000000000000000000000000000000000000000),
    .OE(madr9F), .OUT(DO));
  \dcd4-16  inst15 (
    .S0(ADDR[4]), .S1(ADDR[5]), .S2(ADDR[6]), .S3(ADDR[7]), .E(1'b1), .D0(E0), .D1(E1), .D2(E2), .D3(E3),
    .D4(E4), .D5(E5), .D6(E6), .D7(E7), .D8(E8), .D9(E9), .D10(E10), .D11(E11), .D12(E12), .D13(E13),
    .D14(E14), .D15(E15));
  \dcd4-16  inst16 (
    .S0(ADDR[0]), .S1(ADDR[1]), .S2(ADDR[2]), .S3(ADDR[3]), .E(E0), .D0(madr00), .D1(madr01), .D2(madr02),
    .D3(madr03), .D4(madr04), .D5(madr05), .D6(madr06), .D7(madr07), .D8(madr08), .D9(madr09), .D10(madr0A),
    .D11(madr0B), .D12(madr0C), .D13(madr0D), .D14(madr0E), .D15(madr0F));
  \dcd4-16  inst17 (
    .S0(ADDR[0]), .S1(ADDR[1]), .S2(ADDR[2]), .S3(ADDR[3]), .E(E1), .D0(madr10), .D1(madr11), .D2(madr12),
    .D3(madr13), .D4(madr14), .D5(madr15), .D6(madr16), .D7(madr17), .D8(madr18), .D9(madr19), .D10(madr1A),
    .D11(madr1B), .D12(madr1C), .D13(madr1D), .D14(madr1E), .D15(madr1F));
  \dcd4-16  inst18 (
    .S0(ADDR[0]), .S1(ADDR[1]), .S2(ADDR[2]), .S3(ADDR[3]), .E(E2), .D0(madr20), .D1(madr21), .D2(madr22),
    .D3(madr23), .D4(madr24), .D5(madr25), .D6(madr26), .D7(madr27), .D8(madr28), .D9(madr29), .D10(madr2A),
    .D11(madr2B), .D12(madr2C), .D13(madr2D), .D14(madr2E), .D15(madr2F));
  \dcd4-16  inst19 (
    .S0(ADDR[0]), .S1(ADDR[1]), .S2(ADDR[2]), .S3(ADDR[3]), .E(E3), .D0(madr30), .D1(madr31), .D2(madr32),
    .D3(madr33), .D4(madr34), .D5(madr35), .D6(madr36), .D7(madr37), .D8(madr38), .D9(madr39), .D10(madr3A),
    .D11(madr3B), .D12(madr3C), .D13(madr3D), .D14(madr3E), .D15(madr3F));
  \dcd4-16  inst20 (
    .S0(ADDR[0]), .S1(ADDR[1]), .S2(ADDR[2]), .S3(ADDR[3]), .E(E4), .D0(madr40), .D1(madr41), .D2(madr42),
    .D3(madr43), .D4(madr44), .D5(madr45), .D6(madr46), .D7(madr47), .D8(madr48), .D9(madr49), .D10(madr4A),
    .D11(madr4B), .D12(madr4C), .D13(madr4D), .D14(madr4E), .D15(madr4F));
  \dcd4-16  inst21 (
    .S0(ADDR[0]), .S1(ADDR[1]), .S2(ADDR[2]), .S3(ADDR[3]), .E(E5), .D0(madr50), .D1(madr51), .D2(madr52),
    .D3(madr53), .D4(madr54), .D5(madr55), .D6(madr56), .D7(madr57), .D8(madr58), .D9(madr59), .D10(madr5A),
    .D11(madr5B), .D12(madr5C), .D13(madr5D), .D14(madr5E), .D15(madr5F));
  \dcd4-16  inst22 (
    .S0(ADDR[0]), .S1(ADDR[1]), .S2(ADDR[2]), .S3(ADDR[3]), .E(E6), .D0(madr60), .D1(madr61), .D2(madr62),
    .D3(madr63), .D4(madr64), .D5(madr65), .D6(madr66), .D7(madr67), .D8(madr68), .D9(madr69), .D10(madr6A),
    .D11(madr6B), .D12(madr6C), .D13(madr6D), .D14(madr6E), .D15(madr6F));
  \dcd4-16  inst23 (
    .S0(ADDR[0]), .S1(ADDR[1]), .S2(ADDR[2]), .S3(ADDR[3]), .E(E7), .D0(madr70), .D1(madr71), .D2(madr72),
    .D3(madr73), .D4(madr74), .D5(madr75), .D6(madr76), .D7(madr77), .D8(madr78), .D9(madr79), .D10(madr7A),
    .D11(madr7B), .D12(madr7C), .D13(madr7D), .D14(madr7E), .D15(madr7F));
  TRI inst45[127:0] (
    .IN(128'b00010101000010000000000000000000000000000000000000000000000000000000000000000000000000000000000000000000000000000000000000100001),
    .OE(madr20), .OUT(DO));
  TRI inst46[127:0] (
    .IN(128'b00000000000000000000000000000000000000000000000000000000000000000000000000000000000000000000000000000000110000000000000000000000),
    .OE(madr21), .OUT(DO));
  TRI inst47[127:0] (
    .IN(128'b00010101000010000000000000000000000000000000000000000000000000000000000000000000000000000000000000000000000000000000000000000001),
    .OE(madr22), .OUT(DO));
  TRI inst48[127:0] (
    .IN(128'b00010101000010000000000000000000000000000000000000000000000000000000000000000000000100000000000000000000000000000000000000000000),
    .OE(madr23), .OUT(DO));
  TRI inst49[127:0] (
    .IN(128'b00000000000000000000000000000000000000000000000000000000000000000000000000000000000000000000000000000000110000000000000000000000),
    .OE(madr24), .OUT(DO));
  TRI inst50[127:0] (
    .IN(128'b00010101000010000000000000000000000000000000000000000000000000000000000000000000010100000000000000000000000000000000000000000000),
    .OE(madr25), .OUT(DO));
  TRI inst51[127:0] (
    .IN(128'b00000000000000000000000000000000000000000000000000010000000000000000000000000000000000000000000000000000000000000000000000000000),
    .OE(madr26), .OUT(DO));
  TRI inst52[127:0] (
    .IN(128'b00101001010010000000000000000000000000000000000000000000000000000000000000000000000000000000000000000000000000000000000000000000),
    .OE(madr27), .OUT(DO));
  TRI inst53[127:0] (
    .IN(128'b00100111000010000000000000000000000000000000000000000000000000000000100000000000001000000000010000000000000000000000000000000000),
    .OE(madr28), .OUT(DO));
  TRI inst54[127:0] (
    .IN(128'b10001000000010000000000000000000000000000000000000000000110000000000000000000000000000000000000000000000000000000000000000000000),
    .OE(madr29), .OUT(DO));
  TRI inst55[127:0] (
    .IN(128'b00101100010010000000000000000000000000000000000000000000000000000000000000000000000000000000000000000000000000000000000000000000),
    .OE(madr2A), .OUT(DO));
  TRI inst56[127:0] (
    .IN(128'b00101010000010000000000000000000000000000000000000000000000000000000100000000000001000000000100000000000000000000000000000000000),
    .OE(madr2B), .OUT(DO));
  TRI inst57[127:0] (
    .IN(128'b10001000000010000000000000000000000000000000000000000000110000000000000000000000000000000000000000000000000000000000000000000000),
    .OE(madr2C), .OUT(DO));
  TRI inst58[127:0] (
    .IN(128'b00000000000000000000000000000000000000000000000000000000000000000000000000000000000000000000000000000000000000000000000110000000),
    .OE(madr2D), .OUT(DO));
  TRI inst59[127:0] (
    .IN(128'b00101110000110000000000000000000000000000000000000000100001000000000000000000000000000000000000000000000000000000000000001000000),
    .OE(madr2E), .OUT(DO));
  TRI inst60[127:0] (
    .IN(128'b00000000000000000000000000000000000000000000000000000000000000000000000000000000000000000000000000000000000000000000001010000010),
    .OE(madr2F), .OUT(DO));
  TRI inst109[127:0] (
    .IN(128'b00000000000000000000000000000000000000000000000000000000000000000000000000000100000000000010000100000000000000000000100000010001),
    .OE(madr60), .OUT(DO));
  TRI inst110[127:0] (
    .IN(128'b01100001000110000000000000000000000000000000000000000010000000000000000000000000000000000000000000000000000000000000000011000000),
    .OE(madr61), .OUT(DO));
  TRI inst111[127:0] (
    .IN(128'b00000000000000000000000000000000000000000000000000000000110000000000000000000000000000000000000000000000010000000001000000000000),
    .OE(madr62), .OUT(DO));
  TRI inst112[127:0] (
    .IN(128'b10001000000010000000000000000000000000000000000000000001010000000000011000000000000000000000000000000000000000000000000000000000),
    .OE(madr63), .OUT(DO));
  TRI inst113[127:0] (
    .IN(128'b00000000000000000000000000000000000000000000000000000000000000000000000000000000000000000000000000000001010000000011100000000000),
    .OE(madr64), .OUT(DO));
  TRI inst114[127:0] (
    .IN(128'b00000000000000000000000000000000000000000000000000000000000000000000000000000000000000000000000100000000000000000000000000000000),
    .OE(madr65), .OUT(DO));
  TRI inst115[127:0] (
    .IN(128'b00000000000000000000000000000000000000000000000000000000000000000000000000001000000000000010000100000000000000000000000000000000),
    .OE(madr66), .OUT(DO));
  TRI inst116[127:0] (
    .IN(128'b00000000000000000000000000000000000000000000000000000000000000000000000000001000000000000010000100000000000000000000011110010001),
    .OE(madr67), .OUT(DO));
  TRI inst117[127:0] (
    .IN(128'b01101000000110000000000000000000000000000000000000000100001000000000000000000000000000000000000000000000000000000000000001000000),
    .OE(madr68), .OUT(DO));
  TRI inst118[127:0] (
    .IN(128'b00000000000000000000000000000000000000000000000000000000110000000000000000000000000000000000000000000000000000000000011010010001),
    .OE(madr69), .OUT(DO));
  TRI inst119[127:0] (
    .IN(128'b01101010000110000000000000000000000000000000000000000100001000000000000000000000000000000000000000000000000000000000000001000000),
    .OE(madr6A), .OUT(DO));
  TRI inst120[127:0] (
    .IN(128'b10001000000010000000000000000000000000000000000000000000000000000000000000000000000000000000000000000000000000000000000000000000),
    .OE(madr6B), .OUT(DO));
  TRI inst121[127:0] (
    .IN(128'b10001000000010000000000000000000000000000000000000000000000000000010000000000000000000000000000000000000000000000000000000000000),
    .OE(madr6C), .OUT(DO));
  TRI inst122[127:0] (
    .IN(128'b10001000000010000000000000000000000000000000000000000000000000000000000000000000000000000000000010000000000000000000000000000000),
    .OE(madr6D), .OUT(DO));
  TRI inst123[127:0] (
    .IN(128'b10001000000010000000000000000000000000000000000000000000000000000100000000000000000000000000000000000000000000000000000000000000),
    .OE(madr6E), .OUT(DO));
  TRI inst124[127:0] (
    .IN(128'b10001000000010000000000000000000000000000000000000000000000000010100000000000000000000000000000000000000000000000000000000000000),
    .OE(madr6F), .OUT(DO));
  TRI inst174[127:0] (
    .IN(128'b10100010000010000000000000000000000000000000000000000000000000000000000000000010000000000010000100100100000000000000000000000000),
    .OE(madrA0), .OUT(DO));
  TRI inst175[127:0] (
    .IN(128'b00000000000000000000000000000000000000000000000000000000000000000000000000000000000000000000000000000100000000000000000000000000),
    .OE(madrA1), .OUT(DO));
  TRI inst176[127:0] (
    .IN(128'b10011110100010000000000000000000000000000000000000000000000000000000000000000000001000000000000000000000000000000000000000000000),
    .OE(madrA2), .OUT(DO));
  TRI inst177[127:0] (
    .IN(128'b10100101011010000000000000000000000000000000000000000000000000000000000000000000000000000000000000000000000000000000000000000000),
    .OE(madrA3), .OUT(DO));
  TRI inst178[127:0] (
    .IN(128'b00000000000000000000000000000000000000000000000000000000000000000000000000000000000000000011000100000000000000000000000000000000),
    .OE(madrA4), .OUT(DO));
  TRI inst179[127:0] (
    .IN(128'b10001000000010000000000000000000000000000000000000000000110000000000000000000000000000000000000000000000000000000000000000000000),
    .OE(madrA5), .OUT(DO));
  \dcd4-16  inst24 (
    .S0(ADDR[0]), .S1(ADDR[1]), .S2(ADDR[2]), .S3(ADDR[3]), .E(E8), .D0(madr80), .D1(madr81), .D2(madr82),
    .D3(madr83), .D4(madr84), .D5(madr85), .D6(madr86), .D7(madr87), .D8(madr88), .D9(madr89), .D10(madr8A),
    .D11(madr8B), .D12(madr8C), .D13(madr8D), .D14(madr8E), .D15(madr8F));
  \dcd4-16  inst25 (
    .S0(ADDR[0]), .S1(ADDR[1]), .S2(ADDR[2]), .S3(ADDR[3]), .E(E9), .D0(madr90), .D1(madr91), .D2(madr92),
    .D3(madr93), .D4(madr94), .D5(madr95), .D6(madr96), .D7(madr97), .D8(madr98), .D9(madr99), .D10(madr9A),
    .D11(madr9B), .D12(madr9C), .D13(madr9D), .D14(madr9E), .D15(madr9F));
  \dcd4-16  inst173 (
    .S0(ADDR[0]), .S1(ADDR[1]), .S2(ADDR[2]), .S3(ADDR[3]), .E(E10), .D0(madrA0), .D1(madrA1), .D2(madrA2),
    .D3(madrA3), .D4(madrA4), .D5(madrA5), .D6(madrA6), .D7(madrA7), .D8(madrA8), .D9(madrA9), .D10(madrAA),
    .D11(madrAB), .D12(madrAC), .D13(madrAD), .D14(madrAE), .D15(madrAF));
  TRI inst61[127:0] (
    .IN(128'b00110000000110000000000000000000000000000000000000000100001000000000000000000000000000000000000000000000000000000000000001000000),
    .OE(madr30), .OUT(DO));
  TRI inst62[127:0] (
    .IN(128'b10001000000010000000000000000000000000000000000000000000000000000000000000000000000000000000000000000000000000000000000000000000),
    .OE(madr31), .OUT(DO));
  TRI inst63[127:0] (
    .IN(128'b00000000000000000000000000000000000000000000000000000000000000000000000000000000000000000000000000000000000000000000000110000000),
    .OE(madr32), .OUT(DO));
  TRI inst64[127:0] (
    .IN(128'b00110011000110000000000000000000000000000000000000000100001000000000000000000000000000000000000000000000000000000000000001000000),
    .OE(madr33), .OUT(DO));
  TRI inst65[127:0] (
    .IN(128'b10001000000010000000000000000000000000000000000000000000000000000000000000000000000000000000000000000000000000000000000000000000),
    .OE(madr34), .OUT(DO));
  TRI inst66[127:0] (
    .IN(128'b00110101000110000000000000000000000000000000000000000010000000000000000000000000000000000000000000000000000000000000000011000000),
    .OE(madr35), .OUT(DO));
  TRI inst67[127:0] (
    .IN(128'b00000000000000000000000000000000000000000000000000000000000000000000000000000000000000000000000000000000000000000000100000000010),
    .OE(madr36), .OUT(DO));
  TRI inst68[127:0] (
    .IN(128'b00110111000110000000000000000000000000000000000000000010000000000000000000000000000000000000000000000000000000000000000011000000),
    .OE(madr37), .OUT(DO));
  TRI inst69[127:0] (
    .IN(128'b00000000000000000000000000000000000000000000000000000000000000000000000000000000000000000000000000000000000000000001000000000000),
    .OE(madr38), .OUT(DO));
  TRI inst70[127:0] (
    .IN(128'b10001000000010000000000000000000000000000000000000000001010000000000011000000000000000000000000000000000000000000000000000000000),
    .OE(madr39), .OUT(DO));
  TRI inst71[127:0] (
    .IN(128'b00111010000110000000000000000000000000000000000000000010000000000000000000000000000000000000000000000000000000000000000011000000),
    .OE(madr3A), .OUT(DO));
  TRI inst72[127:0] (
    .IN(128'b10001000000010000000000000000000000000000000000000000001110000000000011000000000000000000000000000000000000000000000000000000000),
    .OE(madr3B), .OUT(DO));
  TRI inst73[127:0] (
    .IN(128'b00000000000000000000000000000000000000000000000000000000000000000000000000000000000000000001000100000000000000000000000000000000),
    .OE(madr3C), .OUT(DO));
  TRI inst74[127:0] (
    .IN(128'b10001000000010000000000000000000000000000000000000000000110000000000011000000000000000000000000000000000000000000000000000000000),
    .OE(madr3D), .OUT(DO));
  TRI inst75[127:0] (
    .IN(128'b10001000000010000000000000000000000000000000000000000000000000000000011000100000000000000000000000000000000000000000000000000000),
    .OE(madr3E), .OUT(DO));
  TRI inst76[127:0] (
    .IN(128'b10001000000010000000000000000000000000000000000000000000010000000000011001000000000000000000000000000000000000000000000000000000),
    .OE(madr3F), .OUT(DO));
  TRI inst125[127:0] (
    .IN(128'b00000000000000000000000000000000000000000000000000000000000000000000000000000000000000000000000000000001010000000000000000000000),
    .OE(madr70), .OUT(DO));
  TRI inst126[127:0] (
    .IN(128'b00000000000000000000000000000000000000000000000000000000000000000000000000000000000000000000000100000000000000000000000000000000),
    .OE(madr71), .OUT(DO));
  TRI inst127[127:0] (
    .IN(128'b00000000000000000000000000000000000000000000000000000000000000000000000000000100000000000010000100000000000000000000000000010001),
    .OE(madr72), .OUT(DO));
  TRI inst128[127:0] (
    .IN(128'b01110011000110000000000000000000000000000000000000000010000000000000000000000000000000000000000000000000000000000000000011000000),
    .OE(madr73), .OUT(DO));
  TRI inst129[127:0] (
    .IN(128'b00000000000000000000000000000000000000000000000000000000000000000000000000000100000000000010000100000000000000000000100000010001),
    .OE(madr74), .OUT(DO));
  TRI inst130[127:0] (
    .IN(128'b01110101000110000000000000000000000000000000000000000010000000000000000000000000000000000000000000000000000000000000000011000000),
    .OE(madr75), .OUT(DO));
  TRI inst131[127:0] (
    .IN(128'b00000000000000000000000000000000000000000000000000000000110000000000000000000000000000000000000000000000000000000001000000000000),
    .OE(madr76), .OUT(DO));
  TRI inst132[127:0] (
    .IN(128'b10001000000010000000000000000000000000000000000000000000000000000000000000000000000000000000000000000000000000100100000000000000),
    .OE(madr77), .OUT(DO));
  TRI inst133[127:0] (
    .IN(128'b00000000000000000000000000000000000000000000000000000000000000000000000000000000000000000000000000000001010000000000000000000000),
    .OE(madr78), .OUT(DO));
  TRI inst134[127:0] (
    .IN(128'b00000000000000000000000000000000000000000000000000000000000000000000000000000000000000000000000100000000000000000000000000000000),
    .OE(madr79), .OUT(DO));
  TRI inst135[127:0] (
    .IN(128'b00000000000000000000000000000000000000000000000000000000000000000000000000000100000000000010000100000000000000000000000000010001),
    .OE(madr7A), .OUT(DO));
  TRI inst136[127:0] (
    .IN(128'b01111011000110000000000000000000000000000000000000000010000000000000000000000000000000000000000000000000000000000000000011000000),
    .OE(madr7B), .OUT(DO));
  TRI inst137[127:0] (
    .IN(128'b01110010000010000000000000000000000000000000000000000000000000000000000100000000000000000000000000000000000000000000000000000000),
    .OE(madr7C), .OUT(DO));
  TRI inst138[127:0] (
    .IN(128'b00000000000000000000000000000000000000000000000000000000000000000000000000000000000000000000000000000001010000000000000000000000),
    .OE(madr7D), .OUT(DO));
  TRI inst139[127:0] (
    .IN(128'b00000000000000000000000000000000000000000000000000000000000000000000000000000000000000000000000100000000000000000000000000000000),
    .OE(madr7E), .OUT(DO));
  TRI inst140[127:0] (
    .IN(128'b00000000000000000000000000000000000000000000000000000000000000000000000000001000000000000010000100000000000000000000000000000000),
    .OE(madr7F), .OUT(DO));
endmodule
